# Altium project KNoT_Thing_DevBoard.PrjPCB
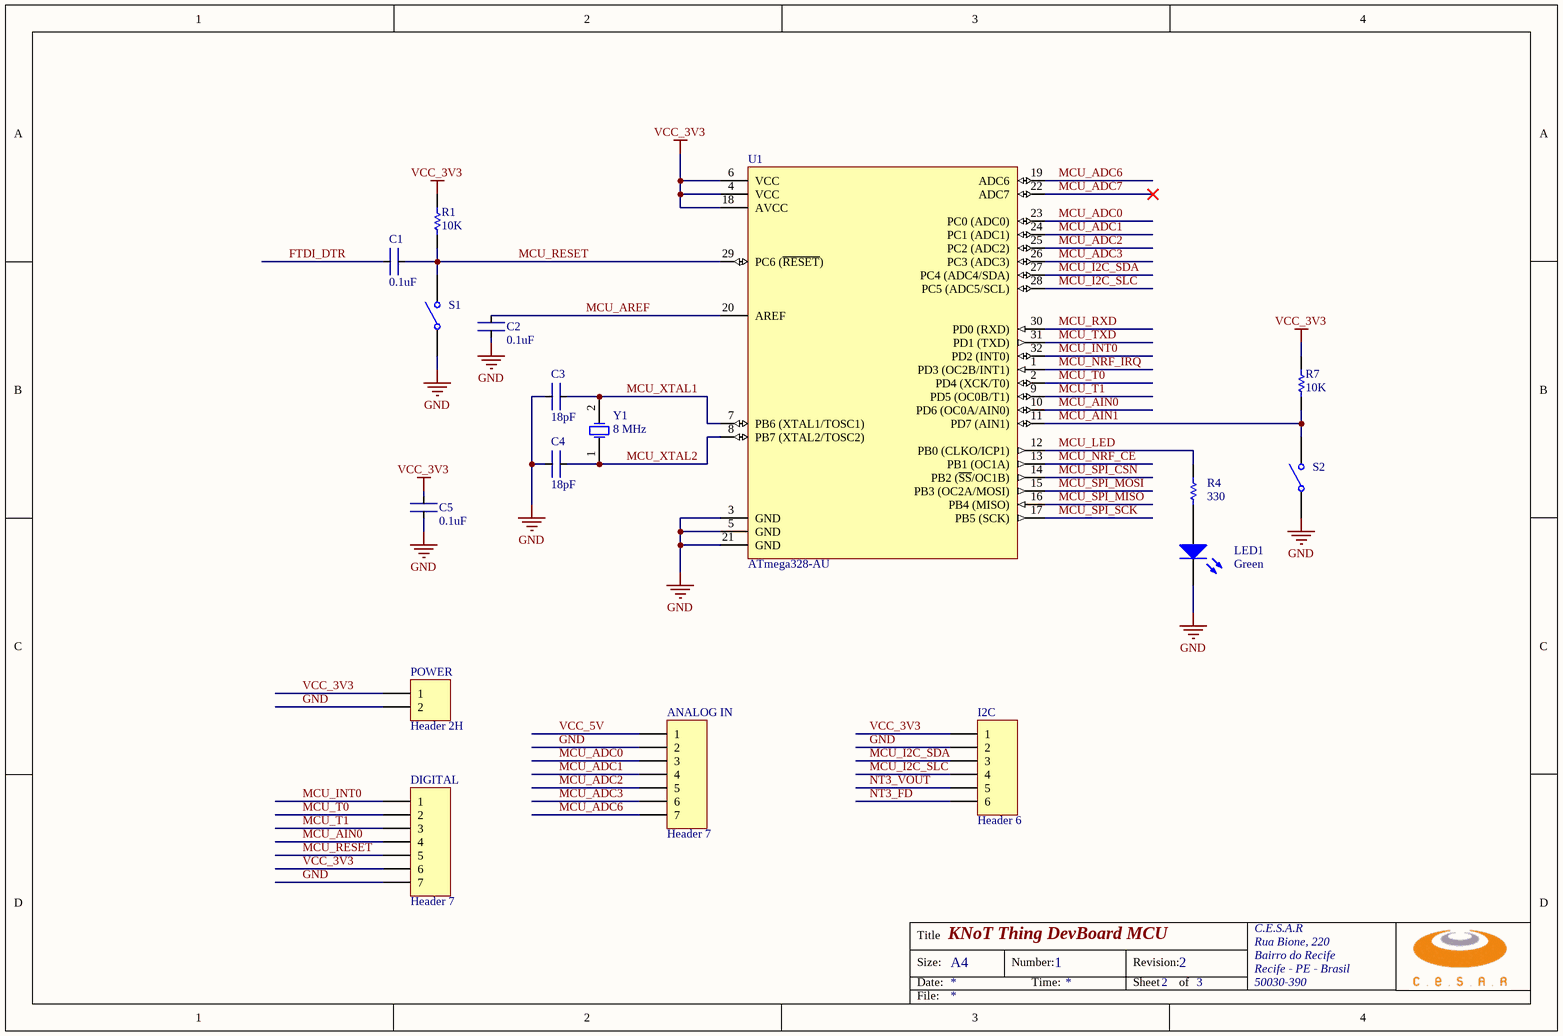
[diagram p0: Knot_Thing_MCU.SchDoc]
3 sheets, 48 parts. Net scope: global (net labels, ports and power ports of the same name join across sheets).
Board file: KNoT_Thing_DevBoard.PcbDoc
Sheets:
  Knot_Thing_MCU.SchDoc
  Knot_Thing_nRF.SchDoc
  Knot_Thing_USB_Power.SchDoc

## Sheet Knot_Thing_MCU.SchDoc: KNoT Thing DevBoard MCU
size A4; Organization: C.E.S.A.R; Address1: Rua Bione, 220; Address2: Bairro do Recife; Address3: Recife - PE - Brasil; Address4: 50030-390; DocumentNumber: 1; Revision: 1; SheetNumber: 2; SheetTotal: 3

### Parts
ANALOG_IN  Header 7  [HDR1X7]
C1  value 0.1uF  [CAPC1005L]  (hidden comment: Cap_0402)
C2  value 0.1uF  [CAPC1005L]  (hidden comment: Cap_0402)
C3  value 18pF  [CAPC1005L]  (hidden comment: Cap_0402)
C4  value 18pF  [CAPC1005L]  (hidden comment: Cap_0402)
C5  value 0.1uF  [CAPC1005L]  (hidden comment: Cap_0402)
DIGITAL  Header 7  [HDR1X7]
I2C  Header 6  [HDR1X6]
LED1  Color: Green  [0603_LED]  (hidden comment: LED 0603)
POWER  Header 2H  [HDR1X2]
R1  value 10K  [CAPC1005L]  (hidden comment: RES_0402)
R4  value 330  [CAPC1005L]  (hidden comment: RES_0402)
R7  value 10K  [CAPC1005L]  (hidden comment: RES_0402)
S1  SW-SPST  [SWITCH TS-1181]  (value not drawn)
S2  SW-SPST  [SWITCH TS-1181]  (value not drawn)
U1  ATmega328-AU  [32A_L]
Y1  8 MHz  [CX5032GB]

### Nets
GND: ANALOG_IN.2 C2.1 C3.1 C4.1 C5.1 DIGITAL.7 I2C.2 LED1.2(K) POWER.2 S1.1(COMMON) S2.1(COMMON) U1.3(GND) U1.5(GND) U1.21(GND)
VCC_3V3: C5.2 DIGITAL.6 I2C.1 POWER.1 R1.2 R7.2 U1.4(VCC) U1.6(VCC) U1.18(AVCC)
VCC_5V: ANALOG_IN.1
FTDI_DTR: C1.1
MCU_ADC0: ANALOG_IN.3 U1.23(PC0_(ADC0))
MCU_ADC1: ANALOG_IN.4 U1.24(PC1_(ADC1))
MCU_ADC2: ANALOG_IN.5 U1.25(PC2_(ADC2))
MCU_ADC3: ANALOG_IN.6 U1.26(PC3_(ADC3))
MCU_ADC6: ANALOG_IN.7 U1.19(ADC6)
MCU_ADC7: U1.22(ADC7)
MCU_AIN0: DIGITAL.4 U1.10(PD6_(OC0A/AIN0))
MCU_AIN1: R7.1 S2.2(NO) U1.11(PD7_(AIN1))
MCU_AREF: C2.2 U1.20(AREF)
MCU_I2C_SDA: I2C.3 U1.27(PC4_(ADC4/SDA))
MCU_I2C_SLC: I2C.4 U1.28(PC5_(ADC5/SCL))
MCU_INT0: DIGITAL.1 U1.32(PD2_(INT0))
MCU_LED: R4.2 U1.12(PB0_(CLKO/ICP1))
MCU_NRF_CE: U1.13(PB1_(OC1A))
MCU_NRF_IRQ: U1.1(PD3_(OC2B/INT1))
MCU_RESET: C1.2 DIGITAL.5 R1.1 S1.2(NO) U1.29(PC6_(~{RESET}))
MCU_RXD: U1.30(PD0_(RXD))
MCU_SPI_CSN: U1.14(PB2_(~{SS}/OC1B))
MCU_SPI_MISO: U1.16(PB4_(MISO))
MCU_SPI_MOSI: U1.15(PB3_(OC2A/MOSI))
MCU_SPI_SCK: U1.17(PB5_(SCK))
MCU_T0: DIGITAL.2 U1.2(PD4_(XCK/T0))
MCU_T1: DIGITAL.3 U1.9(PD5_(OC0B/T1))
MCU_TXD: U1.31(PD1_(TXD))
MCU_XTAL1: C3.2 U1.7(PB6_(XTAL1/TOSC1)) Y1.2(OSC2)
MCU_XTAL2: C4.2 U1.8(PB7_(XTAL2/TOSC2)) Y1.1(OSC1)
NT3_FD: I2C.6
NT3_VOUT: I2C.5
NetLED1_1: LED1.1(A) R4.1

### Notes on the sheet
- Title
- Size:
- Date:
- A4
- Number:
- Time:
- Revision:
- Sheet
- 2
- of
- File:

### Library data of the parts
ANALOG_IN DIGITAL = Header 7: Header, 7-Pin; LatestRevisionDate: 17-Jul-2002; LatestRevisionNote: Re-released for DXP Platform.; Publisher: Altium Limited
C1-C5 = Capacitor_0402: Chip Capacitor 0402 (1005 metric); Supplier 1: Digi-Key
  C1 C2 C5: Supplier Part Number 1: 311-1731-1-ND
  C3 C4: Supplier Part Number 1: 311-1415-1-ND
I2C = Header 6: Header, 6-Pin; LatestRevisionDate: 17-Jul-2002; LatestRevisionNote: Re-released for DXP Platform.; Publisher: Altium Limited
LED1 = LED 0603: LED SMD 0603; Supplier 1: Digi-Key; Supplier Part Number 1: 754-1790-1-ND
POWER = Header 2H: Header, 2-Pin, Right Angle; LatestRevisionDate: 17-Jul-2002; LatestRevisionNote: Re-released for DXP Platform.; Publisher: Altium Limited
R1 R4 R7 = RES_0402: Precision Thick Film Chip Resistor, 10 Ohm to 1M Ohm Range, 1% and 0.5% Tolerance, 0805 Size, 1/8 W; Supplier 1: Digi-Key
  R1 R7: Supplier Part Number 1: 311-2131-1-ND
  R4: Supplier Part Number 1: 311-330JRCT-ND
S1 S2 = SW-SPST: Single-Pole, Single-Throw Switch; Published: 24-Mar-1999; LatestRevisionDate: 17-Jul-2002; LatestRevisionNote: Re-released for DXP Platform.; PackageReference: SPST-2; Publisher: Altium Limited; PackageDescription: Switch; 2 Leads; Supplier 1: Digi-Key; Supplier Part Number 1: CKN10384CT-ND
U1 = ATmega328-AU: 8-bit AVR Microcontroller, 32KB Flash, 1KB EEPROM, 2KB SRAM, 32-pin TQFP, Industrial Grade (-40°C to 85°C); DatasheetVersion: revD, May-2011; PackageVersion: revC, Oct-2010; PackageReference: 32A; PackageDescription: 32-Lead, 7x7x1.0 mm Body, 0.8mm Lead Pitch, Thin Profile Plastic Quad Flat Package (TQFP); Code_JEDEC: MS-026-ABA; ComponentLink1Description: Manufacturer URL; ComponentLink1URL: http://www.atmel.com/; ComponentLink2Description: ATmega48A/48PA/88A/88PA/168A/168PA/328/328P Datasheet; ComponentLink2URL: http://www.atmel.com/dyn/resources/prod_documents/doc8271.pdf; ComponentLink3Description: ATmega48A/48PA/88A/88PA/168A/168PA/328/328P Summary; ComponentLink3URL: http://www.atmel.com/dyn/resources/prod_documents/8271S.pdf; Supplier 1: Digi-Key; Supplier Part Number 1: ATMEGA328-AU-ND
Y1 = XTAL: Crystal FOXSLF/080-20; Supplier 1: Digi-Key; Supplier Part Number 1: 1253-1373-1-ND

## Sheet Knot_Thing_nRF.SchDoc: KNoT Thing DevBoard NRF
size A4; Organization: C.E.S.A.R; Address1: Rua Bione, 220; Address2: Bairro do Recife; Address3: Recife - PE - Brasil; Address4: 50030-390; DocumentNumber: 1; Revision: 1; SheetNumber: 3; SheetTotal: 3
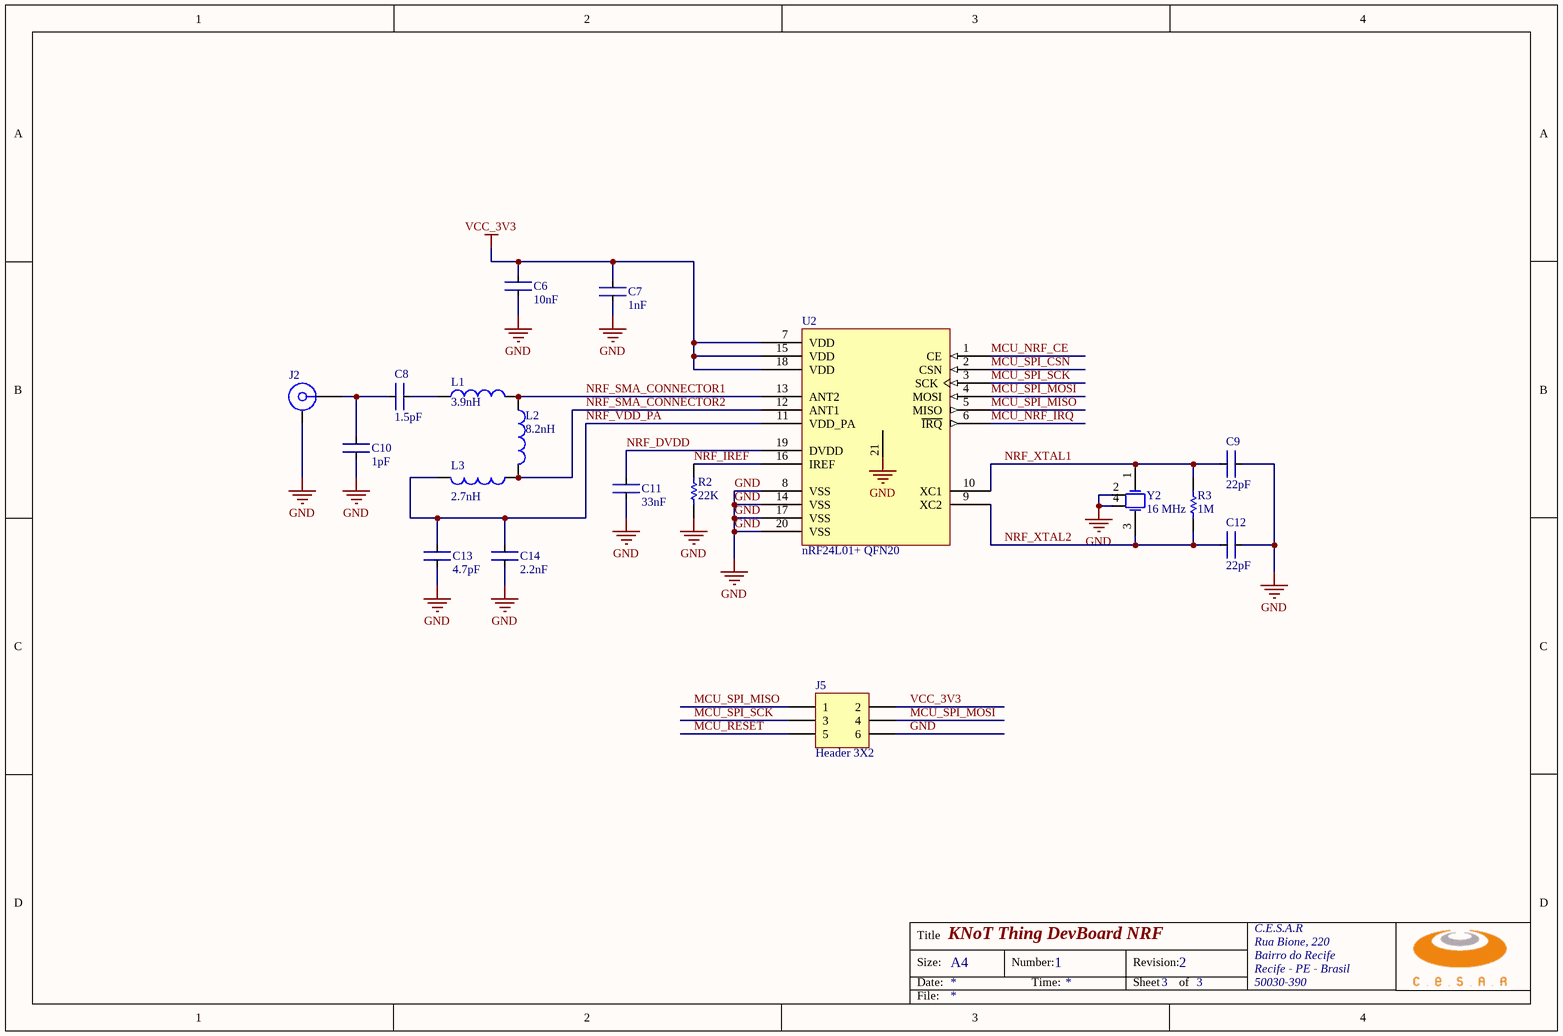
[diagram p1: Knot_Thing_nRF.SchDoc]

### Parts
C6  value 10nF  [CAPC1005L]  (hidden comment: Cap_0402)
C7  value 1nF  [CAPC1005L]  (hidden comment: Cap_0402)
C8  value 1.5pF  [CAPC1005L]  (hidden comment: Cap_0402)
C9  value 22pF  [CAPC1005L]  (hidden comment: Cap_0402)
C10  value 1pF  [CAPC1005L]  (hidden comment: Cap_0402)
C11  value 33nF  [CAPC1005L]  (hidden comment: Cap_0402)
C12  value 22pF  [CAPC1005L]  (hidden comment: Cap_0402)
C13  value 4.7pF  [CAPC1005L]  (hidden comment: Cap_0402)
C14  value 2.2nF  [CAPC1005L]  (hidden comment: Cap_0402)
J2  32K249-400L5  [ROS-32K249-400L5_V]  (value not drawn)
J5  Header 3X2  [HDR2X3]
L1  Inductor0402  [CAPC1005L]  (value not drawn)
L2  Inductor0402  [CAPC1005L]  (value not drawn)
L3  Inductor0402  [CAPC1005L]  (value not drawn)
R2  value 22K  [CAPC1005L]  (hidden comment: RES_0402)
R3  value 1M  [CAPC1005L]  (hidden comment: RES_0402)
U2  nRF24L01+ QFN20  [QFN20]
Y2  16 MHz  [SPK-16M-5032]

### Nets
GND: C6.1 C7.1 C9.1 C10.1 C11.1 C12.2 C13.1 C14.1 J2.MH J5.6 R2.1 U2.8(VSS) U2.14(VSS) U2.17(VSS) U2.20(VSS) U2.21 Y2.2 Y2.4
VCC_3V3: C6.2 C7.2 J5.2 U2.7(VDD) U2.15(VDD) U2.18(VDD)
MCU_NRF_CE: U2.1(CE)
MCU_NRF_IRQ: U2.6(~{IRQ})
MCU_RESET: J5.5
MCU_SPI_CSN: U2.2(CSN)
MCU_SPI_MISO: J5.1 U2.5(MISO)
MCU_SPI_MOSI: J5.4 U2.4(MOSI)
MCU_SPI_SCK: J5.3 U2.3(SCK)
NRF_DVDD: C11.2 U2.19(DVDD)
NRF_IREF: R2.2 U2.16(IREF)
NRF_SMA_CONNECTOR1: L1.2 L2.1 U2.13(ANT2)
NRF_SMA_CONNECTOR2: L2.2 L3.1 U2.12(ANT1)
NRF_VDD_PA: C13.2 C14.2 L3.2 U2.11(VDD_PA)
NRF_XTAL1: C9.2 R3.1 U2.10(XC1) Y2.1(OSC1)
NRF_XTAL2: C12.1 R3.2 U2.9(XC2) Y2.3(OSC2)
NetC8_1: C8.1 C10.2 J2.1
NetC8_2: C8.2 L1.1

### Notes on the sheet
- Title
- Size:
- Date:
- A4
- Number:
- Time:
- Revision:
- Sheet
- 2
- of
- File:
- (in symbol Inductor0402) 3.9nH; 8.2nH; 2.7nH

### Library data of the parts
C6-C14 = Capacitor_0402: Chip Capacitor 0402 (1005 metric); Supplier 1: Digi-Key
  C6: Supplier Part Number 1: 311-1703-1-ND
  C7: Supplier Part Number 1: 311-1352-1-ND
  C8: Supplier Part Number 1: 311-1003-1-ND
  C9 C12: Supplier Part Number 1: 311-1018-1-ND
  C10: Supplier Part Number 1: 311-2076-1-ND
  C11: Supplier Part Number 1: 311-1704-1-ND
  C13: Supplier Part Number 1: 311-1367-1-ND
  C14: Supplier Part Number 1: 311-1707-1-ND
J2 = 32K249-400L5: SMA Right Angle Jack, Up to 18 GHz, -65 to 165 degC; Design Note: Footprint in library is a generic example - only application specific footprint delivers High Performance; DatasheetVersion: b00; PackageVersion: b00; PackageReference: 32K249-400L5; PackageDescription: SMA Right Angle Jack, 14.8 x 6.35 x 9.7 mm; Mounting Technology: Through Hole; PartNumber: 32K249-400L5; ComponentLink1Description: Manufacturer URL; ComponentLink1URL: http://www.rosenberger.de; ComponentLink2Description: Datasheet; ComponentLink2URL: http://rosenberger.de/ok/images/documents/db/32K249-400L5.pdf; ComponentLink3Description: Package Specification; ComponentLink3URL: http://rosenberger.de/ok/images/documents/db/32K249-400L5.pdf; ComponentLink4Description: Series Overview / Design Note; ComponentLink4URL: http://rosenberger.de/ok/images/documents/spez/32.pdf; ComponentLink5Description: Webshop / RFQ; ComponentLink5URL: http://www.rosenberger.com/en/contact/sales/; Supplier 1: Digi-Key; Supplier Part Number 1: ARFX1232-ND
J5 = Header 3X2: Header, 3-Pin, Dual row; LatestRevisionDate: 17-Jul-2002; LatestRevisionNote: Re-released for DXP Platform.; Publisher: Altium Limited
L1-L3 = Inductor0402: Inductor 27nH; Supplier 1: Digi-Key
  L1: Supplier Part Number 1: A103711CT-ND
  L2: Supplier Part Number 1: A102559CT-ND
  L3: Supplier Part Number 1: A103706CT-ND
R2 R3 = RES_0402: as R1 on sheet Knot_Thing_MCU; Supplier 1: Digi-Key
  R2: Supplier Part Number 1: 311-22KJRCT-ND
  R3: Supplier Part Number 1: 311-1.0MJRCT-ND
U2 = nRF24L01+: IC RF TxRx Only General ISM > 1GHZ 2.4GHz; Supplier 1: Digi-Key; Supplier Part Number 1: 1490-1019-ND
Y2 = XTAL_SMD: Crystal FOXSLF/080-20; Supplier 1: Digi-Key; Supplier Part Number 1: 887-1708-1-ND

## Sheet Knot_Thing_USB_Power.SchDoc: KNoT Thing DevBoard USB Power
size A4; Organization: C.E.S.A.R; Address1: Rua Bione, 220; Address2: Bairro do Recife; Address3: Recife - PE - Brasil; Address4: 50030-390; DocumentNumber: 1; Revision: 1; SheetNumber: 1; SheetTotal: 3
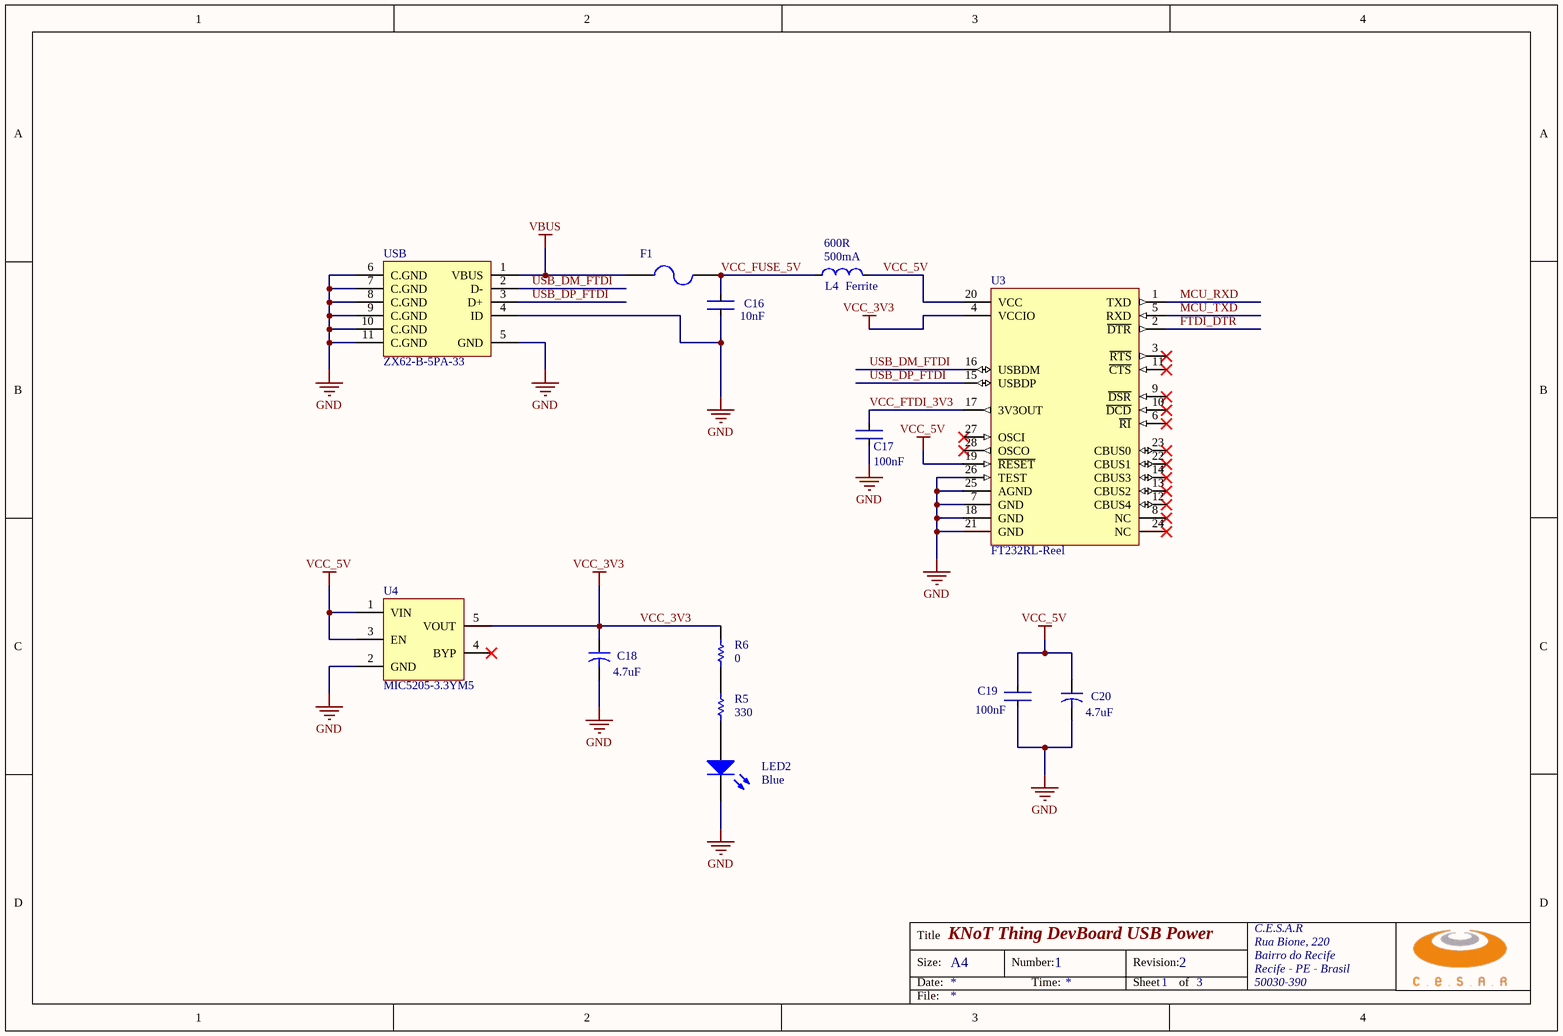
[diagram p2: Knot_Thing_USB_Power.SchDoc]

### Parts
C16  value 10nF  [CAPC1005L]  (hidden comment: Cap_0402)
C17  value 100nF  [CAPC1005L]  (hidden comment: Cap_0402)
C18  value 4.7uF  [CAPC1608L]  (hidden comment: Cap0603)
C19  value 100nF  [CAPC1005L]  (hidden comment: Cap_0402)
C20  value 4.7uF  [CAPC1608L]  (hidden comment: Cap0603)
F1  0402L050SLKR  [0805L]  (value not drawn)
L4  Ferrite  Res: 600R  Cur: 500mA  [0603-cap]
LED2  Color: Blue  [0603_LED]  (hidden comment: LED 0603)
R5  value 330  [CAPC1005L]  (hidden comment: RES_0402)
R6  value 0  [CAPC1005L]  (hidden comment: RES_0402)
U3  FT232RL-Reel  [SSOP-28_N]
U4  MIC5205-3.3YM5  [SOT23-5]
USB  ZX62-B-5PA-33  [Micro USB b]

### Nets
GND: C16.1 C17.2 C18.2 C19.2 C20.2 LED2.2(K) U3.7(GND) U3.18(GND) U3.21(GND) U3.25(AGND) U3.26(TEST) U4.2(GND) USB.4(ID) USB.5(GND) USB.6(C.GND) USB.7(C.GND) USB.8(C.GND) USB.9(C.GND) USB.10(C.GND) USB.11(C.GND)
VBUS: F1.1 USB.1(VBUS)
VCC_3V3: C18.1 R6.2 U3.4(VCCIO) U4.5(VOUT)
VCC_5V: C19.1 C20.1 L4.2 U3.19(~{RESET}) U3.20(VCC) U4.1(VIN) U4.3(EN)
FTDI_DTR: U3.2(~{DTR})
MCU_RXD: U3.1(TXD)
MCU_TXD: U3.5(RXD)
USB_DM_FTDI: U3.16(USBDM) USB.2(D-)
USB_DP_FTDI: U3.15(USBDP) USB.3(D+)
VCC_FTDI_3V3: C17.1 U3.17(3V3OUT)
VCC_FUSE_5V: C16.2 F1.2 L4.1
NetLED2_1: LED2.1(A) R5.1
NetR5_2: R5.2 R6.1

Not connected (* = marked no-connect by the designer): U3 3(~{RTS})* 6(~{RI})* 8(NC)* 9(~{DSR})* 10(~{DCD})* 11(~{CTS})* 12(CBUS4)* 13(CBUS2)* 14(CBUS3)* 22(CBUS1)* 23(CBUS0)* 24(NC)* 27(OSCI)* 28(OSCO)*; U4 4(BYP)*

### Notes on the sheet
- Title
- Size:
- Date:
- A4
- Number:
- Time:
- Revision:
- Sheet
- 2
- of
- File:

### Library data of the parts
C16 C17 C19 = Capacitor_0402: Chip Capacitor 0402 (1005 metric); Supplier 1: Digi-Key
  C16: Supplier Part Number 1: 311-1703-1-ND
  C17 C19: Supplier Part Number 1: 311-1731-1-ND
C18 C20 = Cap0603: 4.7µF 10V Ceramic Capacitor X5R 0603; Published: 23-Sep-2002; Publisher: Altium Limited; PackageDescription: Capacitor; 2 Leads; Supplier 1: Digi-Key; Supplier Part Number 1: 311-1453-1-ND
F1 = Fuse 2: PTC Resettable Fuse 6V 500mA Ih Surface Mount 0402 (1005 Metric), Concave; Supplier 1: Digi-Key; Supplier Part Number 1: F2772CT-ND
L4 = Ferrite: BLM18AG121SN1 FERRITE 120 OHM 500MA 0603; Supplier 1: Digi-Key; Supplier Part Number 1: 445-2166-1-ND
LED2 = LED 0603: LED SMD 0603; Supplier 1: Digi-Key; Supplier Part Number 1: 754-1789-1-ND
R5 R6 = RES_0402: as R1 on sheet Knot_Thing_MCU; Supplier 1: Digi-Key
  R5: Supplier Part Number 1: 311-330JRCT-ND
  R6: Supplier Part Number 1: 311-0.0JRTR-ND
U3 = FT232RL-Reel: USB UART Asynchronous Serial Data Transfer Chip, 28-pin SSOP, Tape and Reel; Manufacturer: FTDI; DatasheetVersion: ver 2.10, Mar-2012; PackageVersion: Mar-12; PackageReference: SSOP-28; PackageDescription: 28-Pin Small Outline Package 0.65 mm Pitch; PartNumber: FT232RL-Reel; ComponentLink1Description: Manufacturer URL; ComponentLink1URL: http://www.ftdichip.com/; ComponentLink2Description: Datasheet; ComponentLink2URL: http://www.ftdichip.com/Support/Documents/DataSheets/ICs/DS_FT232R.pdf; Supplier 1: Digi-Key; Supplier Part Number 1: 768-1007-6-ND
U4 = MIC5205-3.3YM5: Voltage Regulator; Supplier 1: Digi-Key; Supplier Part Number 1: 576-1259-1-ND
USB = ZX62-B-5PA-33: USB Connector; Supplier 1: Digi-Key; Supplier Part Number 1: H125270CT-ND

## Nets that join several sheets
GND: Knot_Thing_MCU (14 pins), Knot_Thing_nRF (18 pins), Knot_Thing_USB_Power (20 pins)
VCC_3V3: Knot_Thing_MCU (9 pins), Knot_Thing_nRF (6 pins), Knot_Thing_USB_Power (C18.1 R6.2 U3.4 U4.5)
VCC_5V: Knot_Thing_MCU (ANALOG_IN.1), Knot_Thing_USB_Power (7 pins)
FTDI_DTR: Knot_Thing_MCU (C1.1), Knot_Thing_USB_Power (U3.2)
MCU_NRF_CE: Knot_Thing_MCU (U1.13), Knot_Thing_nRF (U2.1)
MCU_NRF_IRQ: Knot_Thing_MCU (U1.1), Knot_Thing_nRF (U2.6)
MCU_RESET: Knot_Thing_MCU (5 pins), Knot_Thing_nRF (J5.5)
MCU_RXD: Knot_Thing_MCU (U1.30), Knot_Thing_USB_Power (U3.1)
MCU_SPI_CSN: Knot_Thing_MCU (U1.14), Knot_Thing_nRF (U2.2)
MCU_SPI_MISO: Knot_Thing_MCU (U1.16), Knot_Thing_nRF (J5.1 U2.5)
MCU_SPI_MOSI: Knot_Thing_MCU (U1.15), Knot_Thing_nRF (J5.4 U2.4)
MCU_SPI_SCK: Knot_Thing_MCU (U1.17), Knot_Thing_nRF (J5.3 U2.3)
MCU_TXD: Knot_Thing_MCU (U1.31), Knot_Thing_USB_Power (U3.5)